# Altium schematic sheet LCD.SchDoc
size A4; SheetNumber: 4; SheetTotal: 7
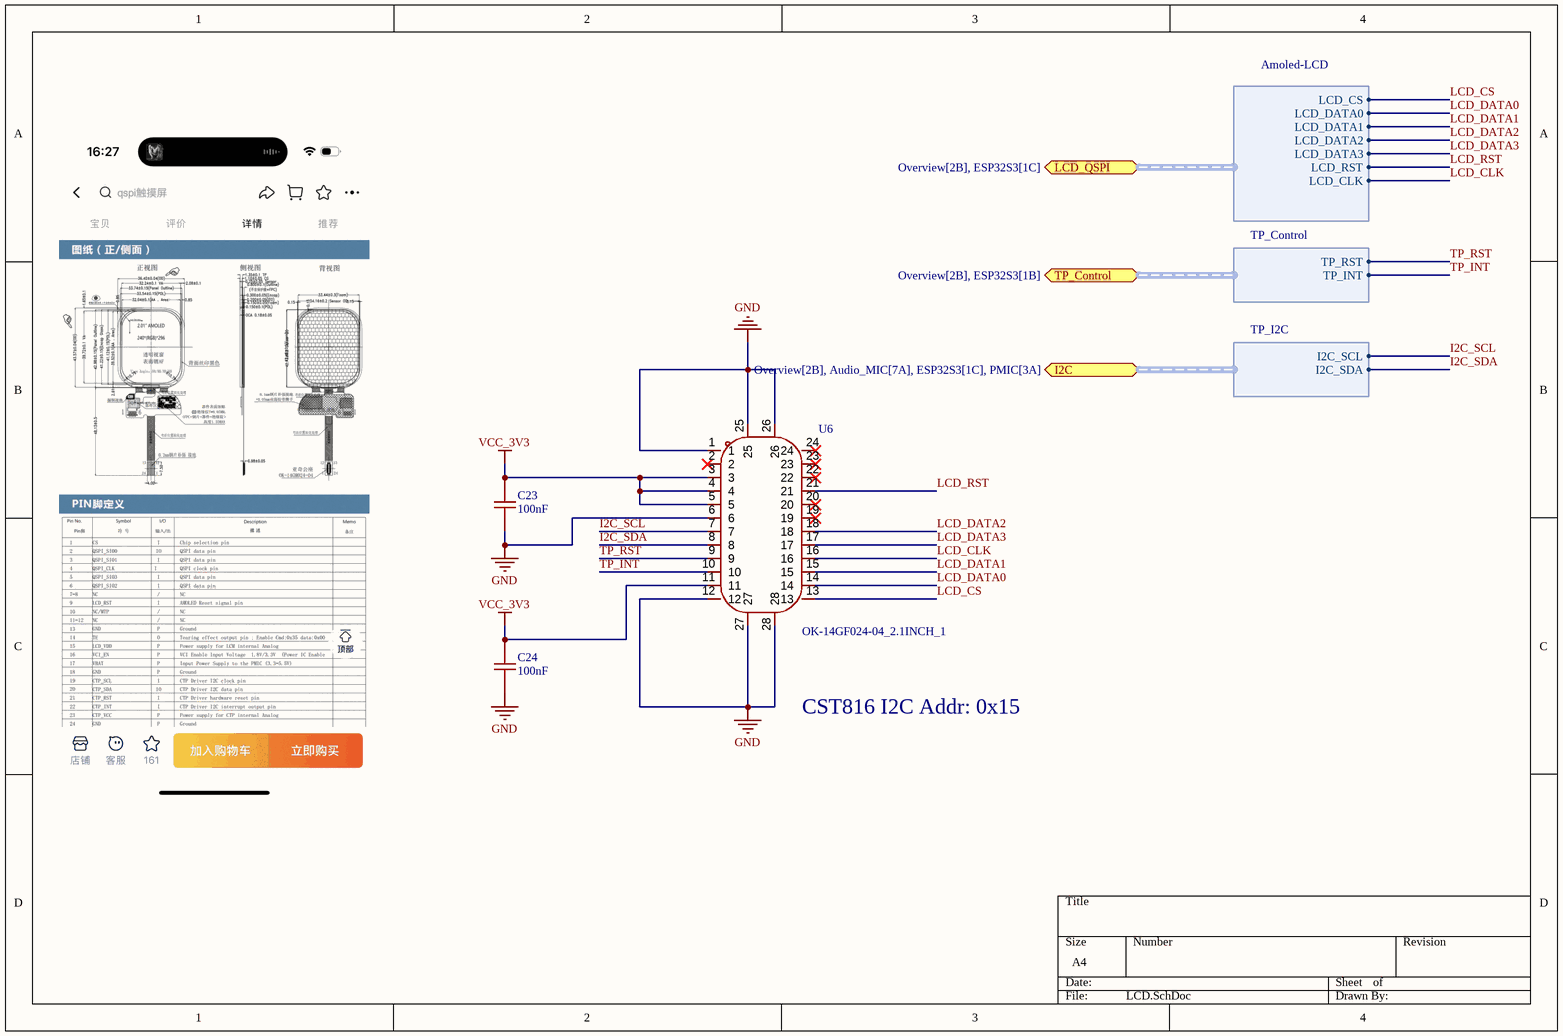
[diagram p0: LCD.SchDoc]

## Parts
C23  100nF  [C0402]
C24  100nF  [C0402]
U6  OK-14GF024-04_2.1INCH_1  [CONN-SMD_24P-P0.40_OK-14GF024-04_2.1INCH]

## Ports
I2C (bidir, harness TP_I2C, see Overview[2B], Audio_MIC[7A], ESP32S3[1C], PMIC[3A]), LCD_QSPI (bidir, harness Amoled-LCD, see Overview[2B], ESP32S3[1C]), TP_Control (bidir, harness TP_Control, see Overview[2B], ESP32S3[1B])

## Harnesses
Amoled-LCD: LCD_CS, LCD_DATA0, LCD_DATA1, LCD_DATA2, LCD_DATA3, LCD_RST, LCD_CLK
TP_I2C: I2C_SCL, I2C_SDA
TP_Control: TP_RST, TP_INT

## Nets
GND: C23.1 C24.1 U6.1 U6.6 U6.12 U6.25 U6.26 U6.27 U6.28
VCC_3V3: C23.2 C24.2 U6.3 U6.4 U6.5 U6.11
I2C_SCL: U6.7 ; port I2C.I2C_SCL
I2C_SDA: U6.8 ; port I2C.I2C_SDA
LCD_CLK: U6.16 ; port LCD_QSPI.LCD_CLK
LCD_CS: U6.13 ; port LCD_QSPI.LCD_CS
LCD_DATA0: U6.14 ; port LCD_QSPI.LCD_DATA0
LCD_DATA1: U6.15 ; port LCD_QSPI.LCD_DATA1
LCD_DATA2: U6.18 ; port LCD_QSPI.LCD_DATA2
LCD_DATA3: U6.17 ; port LCD_QSPI.LCD_DATA3
LCD_RST: U6.21 ; port LCD_QSPI.LCD_RST
TP_INT: U6.10 ; port TP_Control.TP_INT
TP_RST: U6.9 ; port TP_Control.TP_RST

Not connected (* = marked no-connect by the designer): U6 2* 19* 20* 22* 23* 24*

## Notes on the sheet
- CST816 I2C Addr: 0x15

## Library data of the parts
C23 C24 = 100nF: 50V 100nF X7R ±10% 0402 Ceramic Capacitors ROHS
U6 = OK-14GF024-04_2.1INCH_1: OK- 14 0.4mm 24Pin